# Altium schematic sheet WIFI.SchDoc
size B
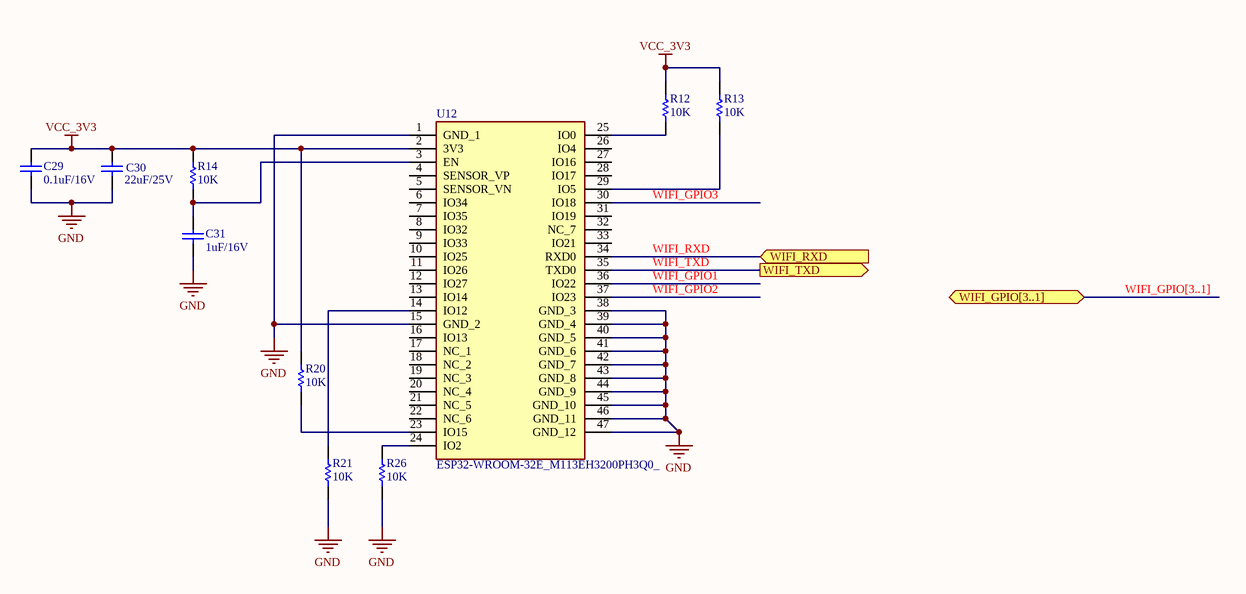
[diagram p0: WIFI.SchDoc]

## Parts
C29  0.1uF/16V  [0603C]
C30  22uF/25V  [1210C]
C31  1uF/16V  [0603C]
R12  10K  [0603R]
R13  10K  [0603R]
R14  10K  [0603R]
R20  10K  [0603R]
R21  10K  [0603R]
R26  10K  [0603R]
U12  ESP32-WROOM-32E_M113EH3200PH3Q0_  [ESP32WROOM32EM113EH3200PH3Q0]

## Ports
WIFI_GPIO[3..1] (bidir), WIFI_RXD (in), WIFI_TXD (out)

## Nets
GND: C29.2 C30.1 C31.2 R21.2 R26.2 U12.1(GND_1) U12.15(GND_2) U12.38(GND_3) U12.39(GND_4) U12.40(GND_5) U12.41(GND_6) U12.42(GND_7) U12.43(GND_8) U12.44(GND_9) U12.45(GND_10) U12.46(GND_11) U12.47(GND_12)
VCC_3V3: C29.1 C30.2 R12.1 R13.1 R14.1 R20.1 U12.2(3V3)
WIFI_GPIO1: U12.36(IO22)
WIFI_GPIO2: U12.37(IO23)
WIFI_GPIO3: U12.30(IO18)
WIFI_RXD: U12.34(RXD0) ; port WIFI_RXD
WIFI_TXD: U12.35(TXD0) ; port WIFI_TXD
NetC31_1: C31.1 R14.2 U12.3(EN)
NetR12_2: R12.2 U12.25(IO0)
NetR13_2: R13.2 U12.29(IO5)
NetR20_2: R20.2 U12.23(IO15)
NetR21_1: R21.1 U12.14(IO12)
NetR26_1: R26.1 U12.24(IO2)

Not connected (* = marked no-connect by the designer): U12 4(SENSOR_VP) 5(SENSOR_VN) 6(IO34) 7(IO35) 8(IO32) 9(IO33) 10(IO25) 11(IO26) 12(IO27) 13(IO14) 16(IO13) 17(NC_1) 18(NC_2) 19(NC_3) 20(NC_4) 21(NC_5) 22(NC_6) 26(IO4) 27(IO16) 28(IO17) 31(IO19) 32(NC_7) 33(IO21)

## Buses and harness runs
bus WIFI_GPIO[3..1] = port WIFI_GPIO[3..1]

## Library data of the parts
C29 = Cap: Multilayer Ceramic Capacitors MLCC - SMD/SMT 0603 16VDC 0.1uF 10% X7R AEC-Q2000; Mfr: Taiyo Yuden; Mfr Part No: EMK107B7104KAHT; Value: 0.1uF/16V; Package: 0603; Price: 0.101; Stockiest: MOUSER; Stockiest Part No: 963-EMK107B7104KAHT
C30 = Cap: Multilayer Ceramic Capacitors MLCC - SMD/SMT 1210 25VDC 22uF 20% X7R AEC-Q200; Mfr: Taiyo Yuden; Mfr Part No: TMK325B7226MMHP; Package: 1210; Price: 0.807; Stockiest: MOUSER; Stockiest Part No: 963-TMK325B7226MMHP; Value: 22uF/25V
C31 = Cap: Multilayer Ceramic Capacitors MLCC - SMD/SMT 16volts 1uF X7R 10%; Mfr: KEMET; Mfr Part No: C0603C105K4RAC7411; Value: 1uF/16V; Package: 0603; Price: 0.101; Stockiest: MOUSER; Stockiest Part No: 80-C0603C105K4RLR
R12-R14 R20 R21 R26 = Res1: Thick Film Resistors - SMD 0603 10Kohms 1% Anti-Sulfur AEC-Q200; Mfr: ROHM Semiconductor; Mfr Part No: SFR03EZPF1002; Value: 10K; Package: 0603; Price: 0.101; Stockiest: MOUSER; Stockiest Part No: 755-SFR03EZPF1002
U12 = ESP32-WROOM-32E_M113EH3200PH3Q0_: Integrated Circuit; Mfr: Espressif Systems; Mfr Part No: ESP32-WROOM-32E(M113EH3200PH3Q0); Price: 2.62; Stockiest: MOUSER; Stockiest Part No: 356-ESP32WRM32E132PH